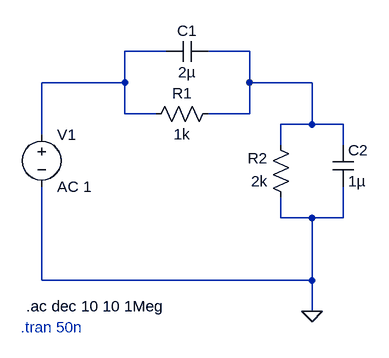
[diagram p0: schematic E_AC.asc]
E_AC.asc, the LTspice schematic file:
Version 4.1
SHEET 1 880 680
WIRE 128 80 64 80
WIRE 256 80 192 80
WIRE 64 128 64 80
WIRE 64 128 -64 128
WIRE 256 128 256 80
WIRE 352 128 256 128
WIRE 64 176 64 128
WIRE 112 176 64 176
WIRE 256 176 256 128
WIRE 256 176 192 176
WIRE 352 192 352 128
WIRE 352 192 304 192
WIRE 400 192 352 192
WIRE -64 208 -64 128
WIRE 304 224 304 192
WIRE 400 224 400 192
WIRE 304 336 304 304
WIRE 352 336 304 336
WIRE 400 336 400 288
WIRE 400 336 352 336
WIRE -64 432 -64 288
WIRE 352 432 352 336
WIRE 352 432 -64 432
WIRE 352 480 352 432
FLAG 352 480 0
SYMBOL cap 192 64 R90
WINDOW 0 0 32 VBottom 2
WINDOW 3 32 32 VTop 2
SYMATTR InstName C1
SYMATTR Value 2µ
SYMBOL res 208 160 R90
WINDOW 0 0 56 VBottom 2
WINDOW 3 32 56 VTop 2
SYMATTR InstName R1
SYMATTR Value 1k
SYMBOL res 320 320 R180
WINDOW 0 36 76 Left 2
WINDOW 3 36 40 Left 2
SYMATTR InstName R2
SYMATTR Value 2k
SYMBOL cap 384 224 R0
SYMATTR InstName C2
SYMATTR Value 1µ
SYMBOL voltage -64 192 R0
WINDOW 123 0 0 Left 0
WINDOW 39 0 0 Left 0
SYMATTR InstName V1
SYMATTR Value AC 1
TEXT -96 504 Left 2 ;.tran 50n
TEXT -88 472 Left 2 !.ac dec 10 10 1Meg

The netlist it stands for:
* E_AC.asc
C1 N002 N001 2µ
R1 N002 N001 1k
R2 0 N002 2k
C2 N002 0 1µ
V1 N001 0 AC 1
* .tran 50n
.ac dec 10 10 1Meg
.backanno
.end